# EAGLE design Adafruit QT Py CH32V203 (EAGLE 9.6.2)
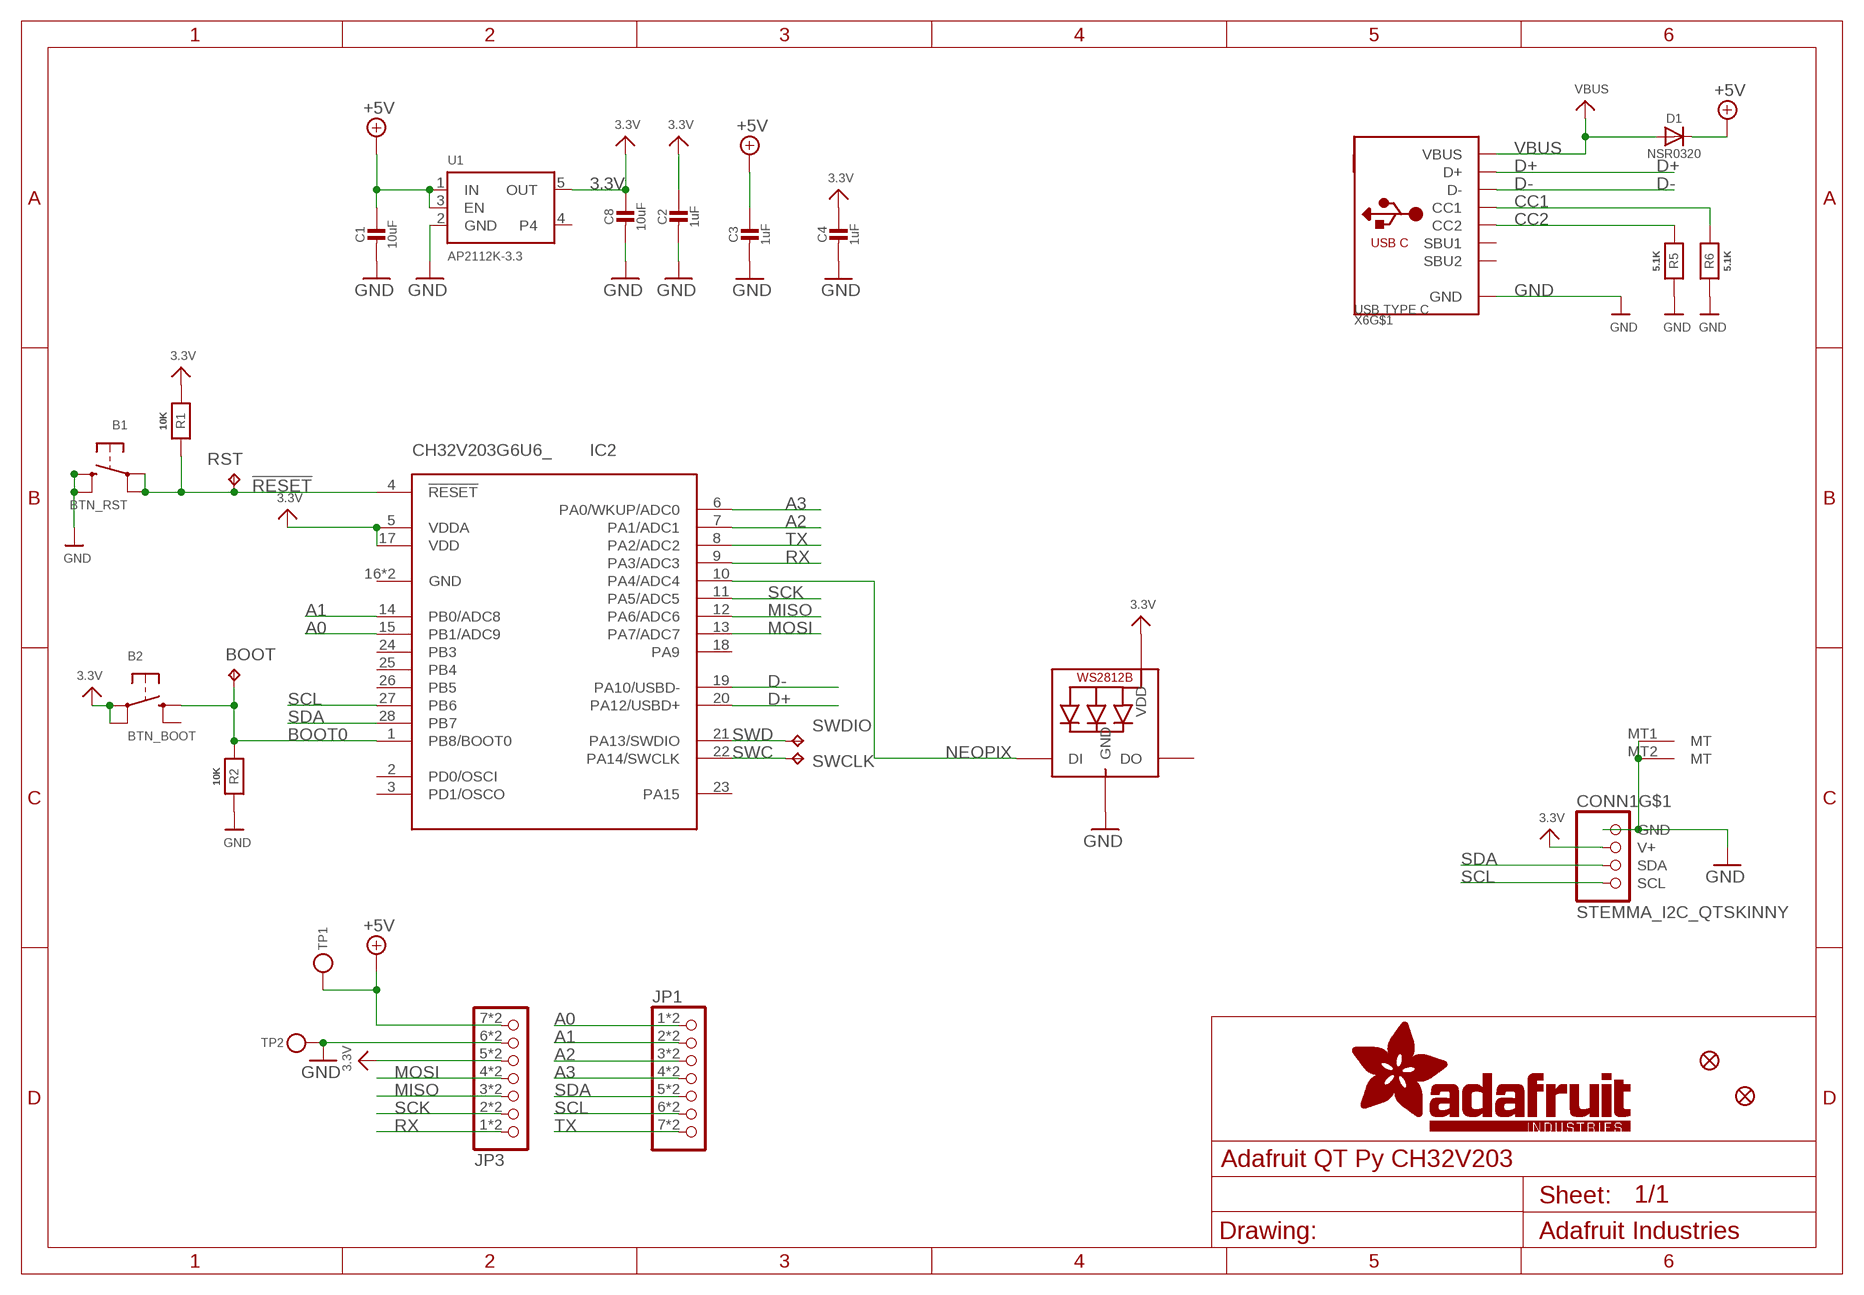
[diagram p0: schematic, sheet 1]

## Parts
B1  BTN_RST  SWITCH_TACT_SMT_RKB2  [BTN_RKB2_4.6X2.8]
B2  BTN_BOOT  SWITCH_TACT_SMT_RKB2  [BTN_RKB2_4.6X2.8]
BOOT  TPB1,27  [B1,27]
C1  10uF  CAP_CERAMIC_0805MP  [_0805MP]
C2  1uF  CAP_CERAMIC_0402NO  [_0402NO]
C3  1uF  CAP_CERAMIC_0402NO  [_0402NO]
C4  1uF  CAP_CERAMIC_0402NO  [_0402NO]
C8  10uF  CAP_CERAMIC_0805MP  [_0805MP]
CONN1  STEMMA_I2C_QTSKINNY  [JST_SH4_SKINNY]
D1  NSR0320  DIODE_SOD323MINI  [SOD-323_MINI]
IC2  CH32V203G6U6_  [QFN28_4MM_0.4MM]
JP1  HEADER-1X7_CASTEL  [1X07_CASTEL]
JP3  HEADER-1X7_CASTEL  [1X07_CASTEL]
LED1  WS2812B_SK6805_1515  [SK6805_1515]
R1  10K  RESISTOR_0402NO  [_0402NO]
R2  10K  RESISTOR_0402NO  [_0402NO]
R5  5.1K  RESISTOR_0402NO  [_0402NO]
R6  5.1K  RESISTOR_0402NO  [_0402NO]
RST  TPB1,27  [B1,27]
SWCLK  SWCLK  TPB1,27  [B1,27]
SWDIO  SWDIO  TPB1,27  [B1,27]
TP1  TESTPOINT_PLUS13  [TESTPOINT_PLUS_1X3MM]
TP2  TESTPOINT_MINUS  [TESTPOINT_MINUS_1X3MM]
U1  AP2112K-3.3  VREG_SOT23-5  [SOT23-5]
U$6  FIDUCIAL_1MM  [FIDUCIAL_1MM]
U$8  FIDUCIAL_1MM  [FIDUCIAL_1MM]
X6  USB TYPE C  USB_C  [USB_C_CUSB31-CFM2AX-01-X]

## Nets
3.3V [power]: B2.A'(P1) B2.A(P) C2.1 C4.1 C8.1 CONN1.2(V+) IC2.5(VDDA) IC2.17(VDD) JP3.5 JP3.5C LED1.2(VDD) R1.1 U1.5(OUT)
!RESET: B1.A'(P1) B1.A(P) IC2.4(!RESET) R1.2 RST.TP
+5V [power]: C1.1 C3.1 D1.C JP3.7 JP3.7C TP1.P$1 U1.1(IN) U1.3(EN)
A0: IC2.15(PB1/ADC9) JP1.1 JP1.1C
A1: IC2.14(PB0/ADC8) JP1.2 JP1.2C
A2: IC2.7(PA1/ADC1) JP1.3 JP1.3C
A3: IC2.6(PA0/WKUP/ADC0) JP1.4 JP1.4C
BOOT0: B2.B(S) BOOT.TP IC2.1(PB8/BOOT0) R2.1
CC1: R6.2 X6.A5(CC1)
CC2: R5.2 X6.B5(CC2)
D+: IC2.20(PA12/USBD+) X6.A6(D+) X6.B6(D+)
D-: IC2.19(PA10/USBD-) X6.A7(D-) X6.B7(D-)
GND [power]: B1.B'(S1) B1.B(S) C1.2 C2.2 C3.2 C4.2 C8.2 CONN1.1(GND) CONN1.MT1(MT) CONN1.MT2(MT) JP3.6 JP3.6C LED1.4(GND) R2.2 R5.1 R6.1 TP2.P$1 U1.2(GND) X6.A1B12(GND) X6.B1A12(GND)
MISO: IC2.12(PA6/ADC6) JP3.3 JP3.3C
MOSI: IC2.13(PA7/ADC7) JP3.4 JP3.4C
NEOPIX: IC2.10(PA4/ADC4) LED1.1(DI)
RX: IC2.9(PA3/ADC3) JP3.1 JP3.1C
SCK: IC2.11(PA5/ADC5) JP3.2 JP3.2C
SCL: CONN1.4(SCL) IC2.27(PB6) JP1.6 JP1.6C
SDA: CONN1.3(SDA) IC2.28(PB7) JP1.5 JP1.5C
SWC: IC2.22(PA14/SWCLK) SWCLK.TP
SWD: IC2.21(PA13/SWDIO) SWDIO.TP
TX: IC2.8(PA2/ADC2) JP1.7 JP1.7C
VBUS [power]: D1.A X6.A4B9(VBUS) X6.B4A9(VBUS)
Unconnected: B2.B'(S1) IC2.2(PD0/OSCI) IC2.3(PD1/OSCO) IC2.18(PA9) IC2.23(PA15) IC2.24(PB3) IC2.25(PB4) IC2.26(PB5) LED1.3(DO) U1.4 X6.A8(SBU1) X6.B8(SBU2) X6.M1(MT) X6.M2(MT) X6.M3(MT) X6.M4(MT)

## Power pins joined to a net without a drawn wire
GND: IC2.16(GND) IC2.THERMAL(GND)

## Library data of the parts
B1 B2 = adafruit_electromech:SWITCH_TACT_SMT: SMT Tact Switches RKB2 https://www.digikey.com/short/m027prz5
BOOT RST SWCLK SWDIO = testpad:TP: Test pad
C1-C4 C8 = microbuilder:CAP_CERAMIC: Ceramic Capacitors For new designs, use the packages preceded by an '_' character since they are more reliable: The following footprints should be used on most boards: _0402 - Standard footprint for regular board layouts _0603 - Standard footprint for regular board layouts _0805 - Standard footprint for regular board layouts _1206 - Standard footprint for regular board layouts For extremely tight-pitch boards where space is at a premium, the following 'micro-pitch' footprints can be used (smaller pads, no silkscreen outline, etc.): _0402MP - Micro-pitch footprint for very dense/compact boards _0603MP - Micro-pitch footprint for very dense/compact boards _0805MP - Micro-pitch footprint for very dense/compact boards _1206MP - Micro-pitch footprint for very dense/compact boards
CONN1 = microbuilder:STEMMA_I2C
D1 = microbuilder:DIODE: Diode SMA Model Volts Amps Type Vf Ir Digikey # Notes SSA34-E3 40V 3A Schottky 480mV @ 3A 200uA @ 40V SSA34-E3/61TGITR-ND CDBA120-G 20V 1A Schottky 500mV @ 1A 500uA @ 20V 641-1014-6-ND REEL MBRA210 10V 2A Schottky 350mV @ 2A 700uA @ 10V MBRA210LT3 SOD-123 Model Volts Amps Type Vf Ir Order # Notes BAT54T1G 30V 200mA Schottky 800mV @ 200mA 2uA @ 25V BAT54T1GOSTR-ND B0530W 30V 500mA Schottky 430mV @ 500mA 130uA @ 30V B0530W-FDICT-ND REEL MBR120 20V 1A Schottky 340mV @ 1A MBR120VLSFT1GOSCT-ND SOD-323 Model Volts Amps Type Vf Ir Order # Notes PMEG2005EJ 20V 500mA Schottky 355mV @ 500mA 568-4110-1-ND ZLLS410 10V 570mA Schottky 380mV @ 570mA ZLLS410CT-ND 1N4148WS 75V 150mA Silicon/Simple 1V 1N4148WSFSCT-ND REEL SOD-523 Model Volts Amps Type Vf Ir Order # Notes BAT54XV2 30V 200mA Schottky 0.8V @ 100mA BAT54XV2CT-ND TB751S 30V 30mA Schottky RB751S-40TE61CT-ND SOT23-R/W (R = Solder Paste/Reflow Ovens, W = Hand-Soldering) Model Volts Amps Type Vf Ir Order # Notes BAT54FILM 40V 300mA Schottky 497-7162-1-ND POWERDI-5 Model Volts Amps Type Vf Ir Order # Notes PDS560 60V 5A Schottky 670mV @ 5A 150uA @ 60V PDS560DICT-ND
IC2 = adafruit_micro:CH32V203G6U6
JP1 JP3 = microbuilder:HEADER-1X7: PIN HEADER
LED1 = microbuilder:WS2812B; LCSC: C2890035
R1 R2 R5 R6 = microbuilder:RESISTOR: Resistors For new designs, use the packages preceded by an '_' character since they are more reliable: The following footprints should be used on most boards: _0402 - Standard footprint for regular board layouts _0603 - Standard footprint for regular board layouts _0805 - Standard footprint for regular board layouts _1206 - Standard footprint for regular board layouts For extremely tight-pitch boards where space is at a premium, the following 'micro-pitch' footprints can be used (smaller pads, no silkscreen outline, etc.): _0402MP - Micro-pitch footprint for very dense/compact boards _0603MP - Micro-pitch footprint for very dense/compact boards _0805MP - Micro-pitch footprint for very dense/compact boards _1206MP - Micro-pitch footprint for very dense/compact boards
TP1 TP2 = microbuilder:TESTPOINT: Test Point Various test points for characterisation and PCB testing TESTPOINT_SMT - Compact Surface Mount Test Point [Digikey: 5016KTR-ND]
U1 = adafruit_power:VREG_SOT23-5: SOT23-5 Fixed Voltage Regulators Part Current Out V Out V In V Dropout θJA (°C/W) TJ (°C) Digikey Part No. ADP121 150mA 3.3V 3.4-5.5V 0.09V @ 150mA -- -- ADP121-AUJZ33R7CT-ND ADP121 150mA 3.0V 3.1-5.5V 0.09V @ 150mA -- -- ADP121-AUJZ30R7CT-ND ADP122 300mA 3.3V 3.4-5.5V 0.085V @ 300mA -- -- ADP122AUJZ-3.3-R7CT-ND ADP1712 300mA 3.3V 3.5-5.5V 0.17V @ 300mA -- -- ADP1712AUJZ-3.3-R7TR-ND AP7311 (Low Cost) 150mA 3.3V 3.5-6V 0.15V @ 150mA -- -- AP7311-33WG-7DICT-ND LD39015M18R 150mA 1.8V 1.9V-5.5V 0.08V @ 100mA -- -- 497-6977-1-ND LP2985A-33DBVR 150mA 3.3V 3.3-16V 0.28V @ 150mA 206 150 296-18479-1-ND MCP1824T-3302E/OT 300mA 3.3V 3.5V-6V 0.2V @ 300mA -- -- MCP1824T-3302E/OTCT-ND MIC5205-2.5YM5 TR 150mA 2.5V 2.7-16V 0.165V @ 150mA -- -- 576-1257-2-ND MIC5205-3.0YM5 TR 150mA 3.0V 3.2V-16V 0.165V @ 150mA -- -- 576-1258-2-ND MIC5205-3.3YM5 TR 150mA 3.3V 3.5V-16V 0.165V @ 150mA -- -- 576-1259-2-ND TPS780330220 150mA 3.3V+2.2V 3.6-5.5V 250mV Max -- -- 296-23332-1-ND TDA3663/N1,135 100mA 3.3V 3.5-45V 0.18V @ 50mA -- -- 568-5343-1-ND Max operating temp can be calculated using θJA, TJ (max junction temperature), and power in watts. Set the "Maximum Ambient Temperature" until it reaches TJ ("Max Junction Temperature"), which is the absolute limit for safe use of the regulator: Heat Sink Temperature Calculator <http://www.daycounter.com/Calculators/Heat-Sink-Temperature-Calculator.phtml> For example, With 12V source into a 3.3V LP2985 and a 30mA load, we are dissipating (12V-3.3V) * 0.03A = 0.261W. With a θJA of 206 °C/W, a TJ of 150°C, and 261mW we can safely use the chip without a heat sink up to 75°C (=147.1°C Junction Temperature).; JLC_ROTATION: 0
U$6 U$8 = microbuilder:FIDUCIAL: Fiducial Alignment Points Various fiducial points for machine vision alignment.; BOM: EXCLUDE
X6 = adafruit_electromech:USB_C: USB Type-C USB 2.0 Connector; LCSC: C165948

## Net classes
1 power: width 0.254 mm
2 gnd: width 0.254 mm

## Board
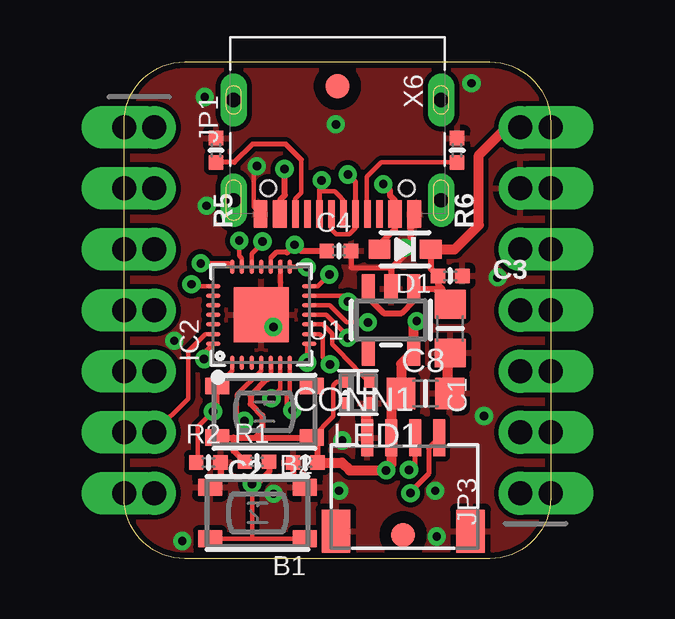
[diagram p1: board, top side]
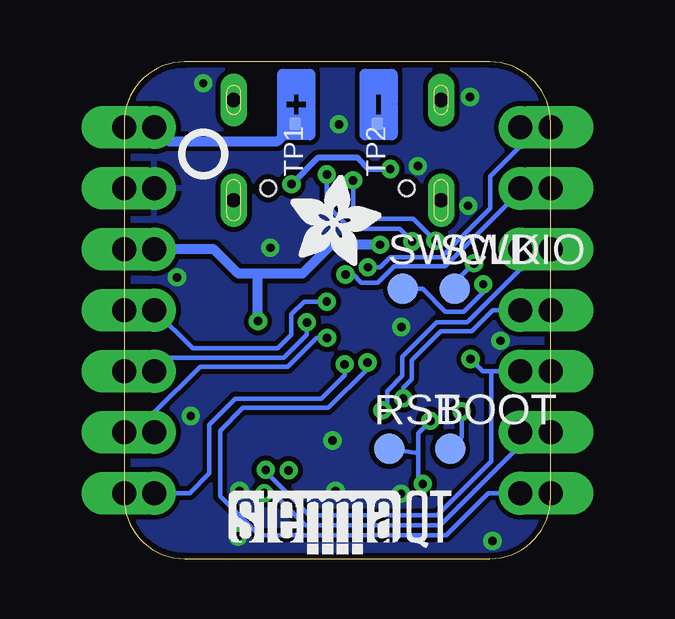
[diagram p2: board, bottom side, seen from below]

Size 17.78 x 20.7 mm. Coordinates in mm from the lower left corner, seen from the top.
Outline: 17.78,18.16 17.78,2.54 arc-90 15.24,0 2.54,0 arc-90 0,2.54 0,18.16 arc-90 2.54,20.7 15.24,20.7 arc-90 17.78,18.16
Copper layers (1*16): Top 0.035mm / dielectric 1.5mm / Bottom 0.035mm
Design rules "adafruit 7-7 *": minimum track width 7mil, minimum drill 13mil, track to track 8mil, track to pad 7mil, pad to pad 7mil, via to via 7mil, smd to smd 7mil, copper to edge 10mil, drill to drill 8mil, minimum pad ring 10mil, minimum via ring 8mil, stop-mask expansion 2mil, vias tented up to drill 20mil, thermal gap 10mil

### Footprints (pad centres in the part's own frame; a part is rotated, then mirrored left to right if it is on the bottom)
BTN_RKB2_4.6X2.8 = smd 1 x 0.7: A 1.973,1.075; A' -1.973,1.075; B 1.973,-1.075; B' -1.973,-1.075
B1,27 = smd 1.27 x 1.27: TP 0,0
_0805MP = smd 1.2 x 1.3: 1 -1.016,0; 2 1.016,0
_0402NO = smd 0.6 x 0.6: 1 -0.508,0; 2 0.508,0
JST_SH4_SKINNY = smd 0.5 x 1.55: 1 -1.5,2.514; 2 -0.5,2.514; 3 0.5,2.514; 4 1.5,2.514 | smd 1.2 x 1.8: MT1 -2.8,-1.386; MT2 2.8,-1.386
SOD-323_MINI = smd 0.9 x 0.8: A 1.07,0; C -1.07,0
QFN28_4MM_0.4MM = smd 0.6 x 0.18: 1 -2,1.2; 2 -2,0.8; 3 -2,0.4; 4 -2,0; 5 -2,-0.4; 6 -2,-0.8; 7 -2,-1.2; 15 2,-1.2; 16 2,-0.8; 17 2,-0.4; 18 2,0; 19 2,0.4; 20 2,0.8; 21 2,1.2 | smd 0.18 x 0.6: 8 -1.2,-2; 9 -0.8,-2; 10 -0.4,-2; 11 0,-2; 12 0.4,-2; 13 0.8,-2; 14 1.2,-2; 22 1.2,2; 23 0.8,2; 24 0.4,2; 25 0,2; 26 -0.4,2; 27 -0.8,2; 28 -1.2,2 | smd 2.3 x 2.3: THERMAL 0,0
1X07_CASTEL = drill 1 pad 1.778: 1 -7.62,0; 2 -5.08,0; 3 -2.54,0; 4 0,0; 5 2.54,0; 6 5.08,0; 7 7.62,0 | drill 1 pad 1.778 long: 1C -7.62,-1.27; 2C -5.08,-1.27; 3C -2.54,-1.27; 4C 0,-1.27; 5C 2.54,-1.27; 6C 5.08,-1.27; 7C 7.62,-1.27
SK6805_1515 = smd 0.5 x 0.5: 1 -0.5,-0.45; 2 0.5,-0.45; 3 0.5,0.45; 4 -0.5,0.45
TESTPOINT_PLUS_1X3MM = smd 0.5 x 0.5: P$1 0.8,-0.05
TESTPOINT_MINUS_1X3MM = smd 0.5 x 0.5: P$1 0.8,-0.05
SOT23-5 = smd 0.55 x 1.2: 1 -0.95,-1.3; 2 0,-1.3; 3 0.95,-1.3; 4 0.95,1.3; 5 -0.95,1.3
FIDUCIAL_1MM = smd 1 x 1: 1 0,0
USB_C_CUSB31-CFM2AX-01-X = smd 0.575 x 1.15: A1B12 -3.2,2.275; A4B9 -2.4,2.275; B1A12 3.2,2.275; B4A9 2.4,2.275 | smd 0.275 x 1.15: A5 -1.25,2.275; A6 -0.25,2.275; A7 0.25,2.275; A8 1.25,2.275; B5 1.75,2.275; B6 0.75,2.275; B7 -0.75,2.275; B8 -1.75,2.275 | drill 0.6 pad 1 long: M1 -4.32,1.7; M2 4.32,1.7; M3 -4.32,-2.48; M4 4.32,-2.48 | hole 0.65: 2.89,1.2; -2.89,1.2

### Placement (x,y rotation side)
B1  5.56,1.91 180 top
B2  5.85,6.12 180 top
BOOT  4.19,4.57 0 bottom
C1  13.59,9.59 270 top
C2  7.56,4 180 top
C3  13.59,11.79 0 top
C4  8.95,12.83 0 top
C8  12.56,6.88 0 top
CONN1  11.63,2.53 0 top
D1  11.71,12.89 180 top
IC2  5.71,10.16 90 top
JP1  1.27,10.35 270 top
JP3  16.51,10.35 90 top
LED1  9.75,6.92 180 top
PLABEL0  [PLABEL0]  6.29,3.05 90 bottom
PLABEL1  [PLABEL1]  3.68,3.05 90 bottom
PLABEL2  [PLABEL2]  8.89,8.95 0 bottom
PLABEL3  [PLABEL3]  5.84,12 90 bottom
PLABEL4  [PLABEL4]  3.56,12 90 bottom
PLABEL5  [PLABEL5]  2.35,17.21 90 bottom
PLABEL6  [PLABEL6]  2.35,14.67 90 bottom
PLABEL7  [PLABEL7]  2.35,12.13 90 bottom
PLABEL8  [PLABEL8]  2.35,9.59 90 bottom
PLABEL9  [PLABEL9]  2.35,7.05 90 bottom
PLABEL10  [PLABEL10]  2.35,4.51 90 bottom
PLABEL11  [PLABEL11]  2.35,1.97 90 bottom
PLABEL12  [PLABEL12]  15.43,3.62 270 bottom
PLABEL13  [PLABEL13]  15.43,6.16 270 bottom
PLABEL14  [PLABEL14]  15.43,8.45 270 bottom
PLABEL15  [PLABEL15]  15.43,11.24 270 bottom
R1  5.54,4.04 0 top
R2  3.52,4.01 0 top
R5  3.84,17.02 270 top
R6  13.88,17.02 270 top
RST  6.73,4.57 0 bottom
SWCLK  6.16,11.24 0 bottom
SWDIO  4,11.24 0 bottom
TP1  10.6,18.92 270 bottom
TP2  7.18,18.92 270 bottom
U1  11.13,9.94 180 top
U$6  11.63,0.99 0 top
U$8  8.89,19.68 0 top
U$11  [ADAFRUIT_3.5MM]  10.86,12.19 0 bottom
U$12  [PCBFEAT-REV-040]  14.48,16.87 0 bottom
U$13  [QTPY_CH32V203_BOT]  17.78,0 0 bottom
U$21  [STEMMAQT]  13.4,0.19 0 bottom
U$23  [QTPY_CH32V203_TOP]  0,0 0 top
X6  8.89,16.64 180 top

### Tracks (layer width: path | path; a pad name or v marks a point on that pad's centre or on a via)
3.3V  (via drill 0.35)
  Top 0.178: IC2.17 6.12,12.54 | 7.75,5.05 B2.A' 8.72,5.93 8.72,7.24 8.86,7.37 LED1.2
  Top 0.203: 6.12,12.54 6.34,12.76 6.79,12.76 | IC2.5 6.12,7.61 6,7.49
  Top 0.254: B2.A 4.57,5.05 | 4.57,5.05 5.46,5.05 | 5.46,5.05 B2.A' | 6.79,12.76 v7.11,13.08 7.37,12.83 C4.1 | C2.1 8.06,4.73 7.75,5.05 | R1.1 4.57,4.5 4.57,5.05 | 6,7.49 5.98,7.49 5.27,6.79 5.27,6.45 5.76,5.96 5.76,5.35 5.46,5.05
  Top 0.406: JP3.5C JP3.5 | B2.A' 7.75,5.05 | C2.1 9.08,4 9.4,3.68 v10.92,3.68 11.13,3.89 CONN1.2 11.13,6.47 C8.1 11.54,8.11 U1.5 12.07,9.78 v12.2,9.9
  Bottom 0.406: v7.11,13.08 9.14,13.08 10.35,11.87 12.19,11.87 | JP3.5C 14.03,12.89 13.02,11.87 12.19,11.87 | v12.2,9.9 12.2,11.87 12.19,11.87
!RESET  (via drill 0.35)
  Top 0.178: B1.A 5.33,0.83 | 5.33,0.83 B1.A' | IC2.4 5.71,7.84 4.7,6.82 4.7,6.06 v5.02,5.74 | 5.44,3.01 v5.33,3.12 5.33,0.83
  Top 0.254: R1.2 6.04,3.61 5.44,3.01
  Bottom 0.178: 5.52,4.39 5.52,5.23 v5.02,5.74 | 5.52,4.39 5.52,3.31 v5.33,3.12 | RST.TP 5.52,4.39
+5V
  Top 0.254: U1.3 10.18,10.88 10.82,10.24 11.57,10.24 12.07,10.74 U1.1 12.95,11.24 | 12.95,11.24 13.27,11.24 13.08,11.44 C3.1 12.78,12.09 D1.C | 12.95,11.24 C1.1
  Top 0.406: JP3.7C JP3.7 15.94,17.97 14.78,16.82 14.78,13.89 13.78,12.89 D1.C
  Bottom 0.406: JP3.7 15.94,17.4 11.38,17.4 TP1.P$1
A0  (via drill 0.35)
  Top 0.178: IC2.15 7.6,12.16 v7.62,12.14
  Top 0.406: JP1.1C JP1.1
  Bottom 0.178: JP1.1C JP1.1 1.27,17.18 2.52,15.94 2.52,14.61 4.56,12.56 6.69,12.56 7.11,12.14 v7.62,12.14
A1  (via drill 0.35)
  Top 0.178: IC2.14 8.07,11.36 v8.55,11.84
  Top 0.406: JP1.2C JP1.2
  Bottom 0.178: v8.55,11.84 8.23,11.84 7.89,11.5 7.21,11.5 6.53,12.18 4.4,12.18 1.27,15.31 JP1.2
A2  (via drill 0.35)
  Top 0.178: v7.01,6.19 6.79,6.41 6.79,6.76 6.92,6.89 IC2.7
  Top 0.406: JP1.3C JP1.3
  Bottom 0.178: v7.01,6.19 6.82,6.38 6.82,6.99 6.18,7.62 6.18,8.42 4.75,9.86 3.48,9.86 1.27,12.06 JP1.3 JP1.3C
A3  (via drill 0.35)
  Top 0.178: IC2.6 6.51,7.05 v6.14,6.68
  Top 0.406: JP1.4C JP1.4
  Bottom 0.178: v6.14,6.68 6.14,7.12 5.8,7.47 5.8,8.27 4.59,9.47 3.29,9.47 2.41,10.35 JP1.4
BOOT0  (via drill 0.35)
  Top 0.178: IC2.1 4.51,7.83 B2.B 3.88,6.31 v3.71,6.13 3.07,5.5 3.07,4.08 R2.1
  Bottom 0.178: BOOT.TP 3.71,5.05 v3.71,6.13
CC1
  Top 0.178: X6.A5 10.12,14.39 10.12,15.91 10.72,16.51 R6.2
CC2
  Top 0.178: 7.39,16.63 7.39,15.25 7.14,15 X6.B5
  Top 0.203: 7.39,16.63 6.75,17.27 5.36,17.27 4.6,16.51 R5.2
D+  (via drill 0.35)
  Top 0.178: IC2.20 4.92,12.51 4.8,12.62 v4.8,13.25 | X6.A6 9.14,14.93 9.04,15.02 9.04,15.05 8.79,15.3 8.14,15.3
  Top 0.203: v8.24,15.77 8.14,15.67 8.14,15.3 X6.B6
  Bottom 0.178: v4.8,13.25 5.72,14.17 8.06,14.17 8.24,14.34 v8.24,15.77
D-  (via drill 0.35)
  Top 0.178: IC2.19 5.32,12.7 5.77,13.15 v5.77,13.22 | 8.64,13.73 8.85,13.52 9.39,13.52 9.65,13.78 9.65,14.35 X6.B7
  Top 0.203: v9.32,16.01 9.64,15.7 X6.B7 | X6.A7 8.64,13.73
  Bottom 0.178: v5.77,13.22 6.3,13.75 8.35,13.75 9.34,14.73 v9.34,16 v9.32,16.01
GND  (via drill 0.35)
  Top 0.178: X6.B1A12 5.4,14.65 5.4,16.22 v5.54,16.36
  Top 0.203: IC2.16 6.51,10.96 | C4.2 9.46,12.13 11.09,12.13 11.12,12.09
  Top 0.254: X6.A1B12 12.09,13.93 11.92,13.76 11.92,12.89 11.12,12.09 U1.2 | 6.51,10.96 IC2.THERMAL | R2.2 4.03,3.42 B1.B | C2.2 7.05,3.47 B1.B'
  Top 0.406: JP3.6C JP3.6 | LED1.4 10.07,6.29 10.07,5.11 CONN1.1 | C8.2 13.46,7 13.46,8.45 C1.2 | v6.22,9.65 IC2.THERMAL
  other vias: 14.48,19.81 11.68,12.95 6.24,2.71 8.97,2.83 13.03,0.93 2.43,0.74 15.57,11.72 9.09,4.93 2.1,9.08 3.37,19.24 8.83,18.1 12.97,2.83 15,5.94 3.44,14.71
  pour Top: 0,0 0,20.64 17.78,20.64 17.78,0
  pour Bottom: 0,0 0,20.64 17.78,20.64 17.78,0
MISO  (via drill 0.35)
  Top 0.178: v10.16,9.85 9.28,9.85 8.57,10.56 IC2.12
  Top 0.254: JP3.3C JP3.3
  Bottom 0.178: JP3.3 15.94,8.38 11.12,8.38 10.16,9.34 v10.16,9.85
MOSI  (via drill 0.35)
  Top 0.178: IC2.13 9.11,10.96 9.34,10.74 v9.34,10.71
  Top 0.406: JP3.4C JP3.4
  Bottom 0.178: JP3.4 14.92,8.76 11.37,8.76 10.8,9.32 10.8,10.18 10.27,10.71 v9.34,10.71
NEOPIX
  Top 0.178: IC2.10 8.29,9.76 8.67,9.38 8.67,8.93 9.63,7.97 9.63,7.93 10.2,7.37 LED1.1
RX  (via drill 0.35)
  Top 0.178: IC2.9 8.15,9.36 8.28,9.23 8.28,8.4 v8.59,8.1
  Top 0.406: JP3.1C JP3.1
  Bottom 0.178: v8.59,8.1 8.59,7.65 9.57,6.67 13.14,6.67 14.22,5.59 14.22,3.56 15.05,2.73 JP3.1
SCK  (via drill 0.35)
  Top 0.178: IC2.11 8.43,10.16 9.32,9.26 v9.32,9.2
  Top 0.406: JP3.2C JP3.2
  Bottom 0.178: JP3.2 16.51,6.1 14.61,8 10.95,8 9.75,9.2 v9.32,9.2
SCL  (via drill 0.35)
  Top 0.178: IC2.27 3.39,9.36 2.67,8.64 2.67,6.67 JP1.6
  Top 0.203: CONN1.4 12.69,4.6 12.69,3.54 11.94,2.79 v11.94,2.73
  Top 0.406: JP1.6C JP1.6
  Bottom 0.178: v11.94,2.73 11.56,2.73 10.22,1.4 4.59,1.4 1.27,4.72 JP1.6
SDA  (via drill 0.35)
  Top 0.178: IC2.28 3.34,8.59 v3.34,8.32
  Top 0.203: v11.87,3.7 12.13,3.7 CONN1.3
  Top 0.406: JP1.5C JP1.5
  Bottom 0.178: JP1.5C 2.48,7.81 | 2.48,7.81 2.83,7.81 v3.34,8.32 | v11.87,3.7 11.87,3.62 10.07,1.82 4.72,1.82 2.48,4.06 2.48,7.81
SWC  (via drill 0.35)
  Top 0.178: IC2.22 2.89,11.36 v2.81,11.44
  Bottom 0.178: SWCLK.TP 5.33,11.24 4.39,10.3 3.62,10.3 2.81,11.11 v2.81,11.44
SWD  (via drill 0.35)
  Top 0.178: IC2.21 4.37,12.31 v3.2,12.31
  Bottom 0.178: SWDIO.TP 4.26,11.24 v3.2,12.31
TX  (via drill 0.35)
  Top 0.178: IC2.8 7.63,8.88 v7.63,8.17
  Top 0.406: JP1.7C JP1.7
  Bottom 0.178: v7.63,8.17 7.63,7.92 9.27,6.29 12.83,6.29 13.78,5.33 13.78,2.6 12.15,0.98 4.36,0.98 2.6,2.73 JP1.7
VBUS  (via drill 0.35)
  Top 0.254: D1.A 10.64,13.08 11.29,13.73 X6.A4B9 11.29,14.93 11.07,15.14 11.07,15.34 v10.8,15.61 | X6.B4A9 6.49,14.93 6.71,15.14 6.71,16.03 6.59,16.14 v6.68,16.24
  Bottom 0.254: v6.68,16.24 7.57,16.24 8.04,16.7 9.71,16.7 v10.8,15.61

### Text on the board
Pinguin_bBackup: 5V | B1 | 1.1 | B0 | 1.4 | GND | P1.5 | 3V | A1 | D | C | A7 | A0 | P3.2 | P1.5 | P3.4 | CH32V203G6 | A6 | P1.6 | B7 | CH552 | A5 | B6 | 3.3 | 1.7 | A3 | B | 3.1 | R | 3.0 | A2